# Altium project PCB_Project1.PrjPCB
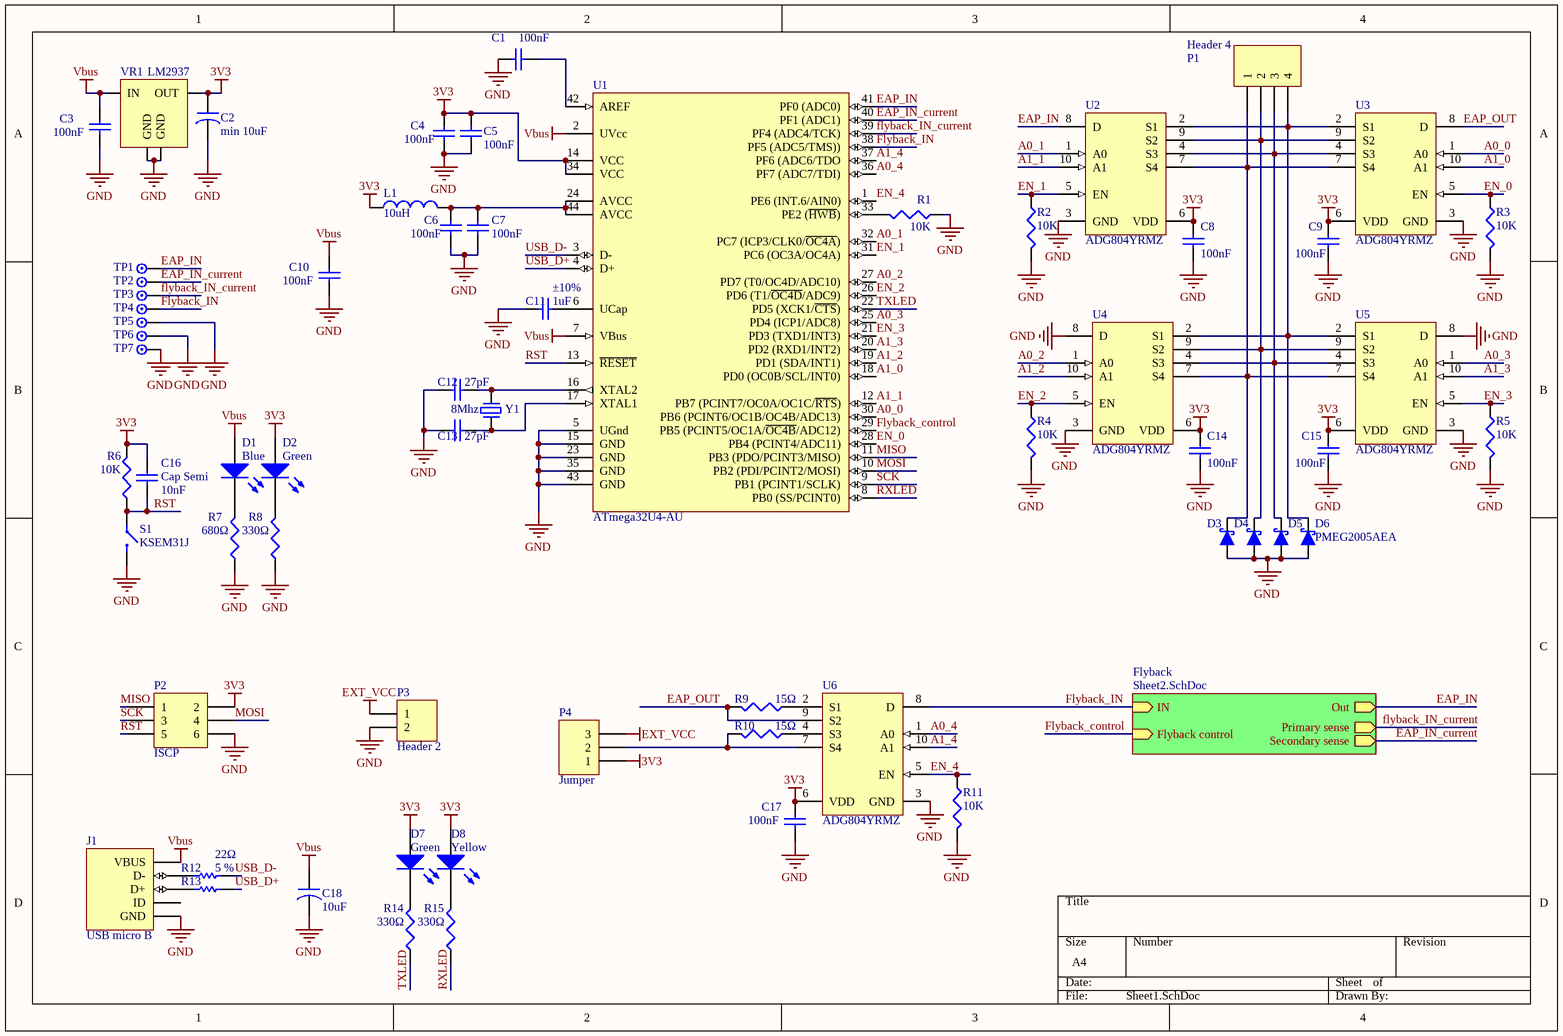
[diagram p0: Sheet1.SchDoc]
2 sheets, 79 parts. Net scope: hierarchical (ports join the sheet entries above them; power ports are global).
Board file: Third_PCB.PcbDoc
Sheets:
  Sheet1.SchDoc
    Flyback = Sheet2.SchDoc

## Sheet Sheet1.SchDoc
size A4

### Parts
C1  value 100nF  [1608[0603]]  (hidden comment: Cap Semi)
C2  min 10uF  [CAPMP3216X18N]
C3  value 100nF  [1608[0603]]  (hidden comment: Cap Semi)
C4  value 100nF  [1608[0603]]  (hidden comment: Cap Semi)
C5  value 100nF  [1608[0603]]  (hidden comment: Cap Semi)
C6  value 100nF  [1608[0603]]  (hidden comment: Cap Semi)
C7  value 100nF  [1608[0603]]  (hidden comment: Cap Semi)
C8  value 100nF  [1608[0603]]  (hidden comment: Cap Semi)
C9  value 100nF  [1608[0603]]  (hidden comment: Cap Semi)
C10  value 100nF  [1608[0603]]  (hidden comment: Cap Semi)
C11  value 1uF  Tolerance: ±10%  [CAPC0603(1608)100_L]  (hidden comment: CAP 1uF 25V 0603(1608))
C12  value 27pF  [CAPC0603(1608)100_N]  (hidden comment: CAP 27pF 50V 0603(1608))
C13  value 27pF  [CAPC0603(1608)100_N]  (hidden comment: CAP 27pF 50V 0603(1608))
C14  value 100nF  [1608[0603]]  (hidden comment: Cap Semi)
C15  value 100nF  [1608[0603]]  (hidden comment: Cap Semi)
C16  Cap Semi  value 10nF  [1608[0603]]
C17  value 100nF  [1608[0603]]  (hidden comment: Cap Semi)
C18  10uF  [CAPMP3216X18N]
D1  Blue  [1608[0603]]
D2  Green  [1608[0603]]
D3  PMEG2005AEA  [SOD323F]  (value not drawn)
D4  PMEG2005AEA  [SOD323F]  (value not drawn)
D5  PMEG2005AEA  [SOD323F]  (value not drawn)
D6  PMEG2005AEA  [SOD323F]
D7  Green  [1608[0603]]
D8  Yellow  [1608[0603]]
J1  USB micro B  [FCI MICRO USB B Receptable]
L1  value 10uH  [INDC4532]  (hidden comment: Inductor)
P1  Header 4  [HDR1X4]
P2  ISCP  [HDR2X3]
P3  Header 2  [HDR1X2]
P4  Jumper  [HDR1X3]
R1  value 10K  [J1-0603]  (hidden comment: Res3)
R2  value 10K  [J1-0603]  (hidden comment: Res3)
R3  value 10K  [J1-0603]  (hidden comment: Res3)
R4  value 10K  [J1-0603]  (hidden comment: Res3)
R5  value 10K  [J1-0603]  (hidden comment: Res3)
R6  value 10K  [J1-0603]  (hidden comment: Res3)
R7  value 680Ω  [J1-0603]  (hidden comment: Res3)
R8  value 330Ω  [J1-0603]  (hidden comment: Res3)
R9  value 15Ω  [J1-0603]  (hidden comment: Res3)
R10  value 15Ω  [J1-0603]  (hidden comment: Res3)
R11  value 10K  [J1-0603]  (hidden comment: Res3)
R12  value 22Ω  Tolerance: 5 %  [RESC0603(1608)_N]  (hidden comment: 22R 5% 0603(1608))
R13  22R 5% 0603(1608)  [RESC0603(1608)_N]  (value not drawn)
R14  value 330Ω  [J1-0603]  (hidden comment: Res3)
R15  value 330Ω  [J1-0603]  (hidden comment: Res3)
S1  KSEM31J  [KSEM31J]
TP1  Testpoint  [Hawin testpoint]  (value not drawn)
TP2  Testpoint  [Hawin testpoint]  (value not drawn)
TP3  Testpoint  [Hawin testpoint]  (value not drawn)
TP4  Testpoint  [Hawin testpoint]  (value not drawn)
TP5  Testpoint  [Hawin testpoint]  (value not drawn)
TP6  Testpoint  [Hawin testpoint]  (value not drawn)
TP7  Testpoint  [Hawin testpoint]  (value not drawn)
U1  ATmega32U4-AU  [44ML_M]
U2  ADG804YRMZ  [ADI-RM-10_L]
U3  ADG804YRMZ  [ADI-RM-10_L]
U4  ADG804YRMZ  [ADI-RM-10_L]
U5  ADG804YRMZ  [ADI-RM-10_L]
U6  ADG804YRMZ  [ADI-RM-10_L]
VR1  LM2937  [LM2937 - SOT230P700X180-4N]
Y1  8Mhz  [ABM3]

### Sub-sheets
Flyback = Sheet2.SchDoc: IN (in), Out (out), Primary sense (out), Secondary sense (out), Flyback control (in)

### Nets
3V3: C2.2 C4.2 C5.2 C8.2 C9.2 C14.2 C15.2 C16.2 C17.2 D2.1(A) D7.1(A) D8.1(A) L1.1 P2.2 P4.1 R6.2 U1.14(VCC) U1.34(VCC) U2.6(VDD) U3.6(VDD) U4.6(VDD) U5.6(VDD) U6.6(VDD) VR1.3(OUT)
EXT_VCC: P3.1 P4.3
GND: C1.2 C2.1 C3.1 C4.1 C5.1 C6.1 C7.1 C8.1 C9.1 C10.1 C11.1 C12.1 C13.1 C14.1 C15.1 C17.1 C18.1 D3.2 D4.2 D5.2 D6.2 J1.GND P2.6 P3.2 R1.1 R2.2 R3.2 R4.2 R5.2 R7.1 R8.1 R11.2 S1.1 TP5.0 TP6.0 TP7.0 U1.5(UGnd) U1.15(GND) U1.23(GND) U1.35(GND) U1.43(GND) U2.3(GND) U3.3(GND) U4.3(GND) U4.8(D) U5.3(GND) U5.8(D) U6.3(GND) VR1.2(GND) VR1.4(GND)
Vbus: C3.2 C10.2 C18.2 D1.1(A) J1.Vbus(VBUS) U1.2(UVcc) U1.7(VBus) VR1.1(IN)
A0_0: U1.30(PB6_(PCINT6/OC1B/OC4B/ADC13)) U3.1(A0)
A0_1: U1.32(PC7_(ICP3/CLK0/~{OC4A})) U2.1(A0)
A0_2: U1.27(PD7_(T0/OC4D/ADC10)) U4.1(A0)
A0_3: U1.25(PD4_(ICP1/ADC8)) U5.1(A0)
A0_4: U1.36(PF7_(ADC7/TDI)) U6.1(A0)
A1_0: U1.18(PD0_(OC0B/SCL/INT0)) U3.10(A1)
A1_1: U1.12(PB7_(PCINT7/OC0A/OC1C/~{RTS})) U2.10(A1)
A1_2: U1.19(PD1_(SDA/INT1)) U4.10(A1)
A1_3: U1.20(PD2_(RXD1/INT2)) U5.10(A1)
A1_4: U1.37(PF6_(ADC6/TDO) U6.10(A1)
EAP_IN: TP1.0 U1.41(PF0_(ADC0)) U2.8(D) ; sheet Flyback/Out
EAP_IN_current: TP2.0 U1.40(PF1_(ADC1)) ; sheet Flyback/Secondary sense
EAP_OUT: R9.1 U3.8(D) U6.9(S2)
EN_0: R3.1 U1.28(PB4_(PCINT4/ADC11)) U3.5(EN)
EN_1: R2.1 U1.31(PC6_(OC3A/OC4A)) U2.5(EN)
EN_2: R4.1 U1.26(PD6_(T1/~{OC4D}/ADC9)) U4.5(EN)
EN_3: R5.1 U1.21(PD3_(TXD1/INT3)) U5.5(EN)
EN_4: R11.1 U1.1(PE6_(INT.6/AIN0)) U6.5(EN)
Flyback_control: U1.29(PB5_(PCINT5/OC1A/~{OC4B}/ADC12)) ; sheet Flyback/Flyback control
Flyback_IN: TP4.0 U1.38(PF5_(ADC5/TMS))) U6.8(D) ; sheet Flyback/IN
flyback_IN_current: TP3.0 U1.39(PF4_(ADC4/TCK)) ; sheet Flyback/Primary sense
MISO: P2.1 U1.11(PB3_(PDO/PCINT3/MISO))
MOSI: P2.4 U1.10(PB2_(PDI/PCINT2/MOSI))
RST: C16.1 P2.5 R6.1 S1.0 U1.13(~{RESET})
RXLED: R15.1 U1.8(PB0_(SS/PCINT0))
SCK: P2.3 U1.9(PB1_(PCINT1/SCLK))
TXLED: R14.1 U1.22(PD5_(XCK1/~{CTS}))
USB_D+: R13.2 U1.4(D+)
USB_D-: R12.2 U1.3(D-)
NetC1_1: C1.1 U1.42(AREF)
NetC6_2: C6.2 C7.2 L1.2 U1.24(AVCC) U1.44(AVCC)
NetC11_2: C11.2 U1.6(UCap)
NetC12_2: C12.2 U1.16(XTAL2) Y1.1
NetC13_2: C13.2 U1.17(XTAL1) Y1.2
NetD1_2: D1.2(K) R7.2
NetD2_2: D2.2(K) R8.2
NetD3_1: D3.1 P1.1 U2.7(S4) U3.7(S4) U4.7(S4) U5.7(S4)
NetD4_1: D4.1 P1.2 U2.9(S2) U3.9(S2) U4.9(S2) U5.9(S2)
NetD5_1: D5.1 P1.3 U2.4(S3) U3.4(S3) U4.4(S3) U5.4(S3)
NetD6_1: D6.1 P1.4 U2.2(S1) U3.2(S1) U4.2(S1) U5.2(S1)
NetD7_2: D7.2(K) R14.2
NetD8_2: D8.2(K) R15.2
NetJ1_D+: J1.D+ R13.1
NetJ1_D-: J1.D- R12.1
NetP4_2: P4.2 R10.1 U6.7(S4)
NetR1_2: R1.2 U1.33(PE2_(~{HWB}))
NetR9_2: R9.2 U6.2(S1)
NetR10_2: R10.2 U6.4(S3)

Not connected (* = marked no-connect by the designer): J1 ID

### Library data of the parts
C1 C3-C10 C14-C17 = Cap Semi: Capacitor (Semiconductor SIM Model); Published: 8-Jun-2000; LatestRevisionDate: 29-May-2009; LatestRevisionNote: IPC-7351 Footprint Added.; PackageReference: C1206; Publisher: Altium Limited; PackageDescription: Chip Capacitor
C2 C18 = Tantalum
C11 = CMP-1035-00880-1: Case-Metric: 1608; Case-EIA: 0603; Technology: SMT; Rated Voltage: 25 V; Max Thickness: 1 mm
C12 C13 = CMP-1035-00010-1: Case-Metric: 1608; Tolerance: 5%; Case-EIA: 0603; Technology: SMT; Max Thickness: 1 mm; Rated Voltage: 50 V
D1 D2 D7 D8 = LED2: Typical RED, GREEN, YELLOW, AMBER GaAs LED; Published: 8-Jun-2000; LatestRevisionDate: 17-Jul-2002; LatestRevisionNote: Re-released for DXP Platform.; PackageVersion: Feb-2002; PackageReference: 3.2X1.6X1.1; Publisher: Altium Limited; PackageDescription: SM LED; 2 Flat Leads
L1 = Inductor: Code_IEC: 1005; Published: 8-Jun-2000; LatestRevisionDate: 29-May-2009; LatestRevisionNote: IPC-7351 Footprint Added.; PackageReference: 0402-A; Publisher: Altium Limited; PackageDescription: Chip Inductor; Code_JEITA: 0402
P1 = Header 4: Header, 4-Pin; LatestRevisionDate: 17-Jul-2002; LatestRevisionNote: Re-released for DXP Platform.; Publisher: Altium Limited
P2 = Header 3X2: Header, 3-Pin, Dual row; LatestRevisionDate: 17-Jul-2002; LatestRevisionNote: Re-released for DXP Platform.; Publisher: Altium Limited
P3 = Header 2: Header, 2-Pin; LatestRevisionDate: 17-Jul-2002; LatestRevisionNote: Re-released for DXP Platform.; Publisher: Altium Limited
P4 = Header 3: Header, 3-Pin; LatestRevisionDate: 17-Jul-2002; LatestRevisionNote: Re-released for DXP Platform.; Publisher: Altium Limited
R1-R11 R14 R15 = Res3: Resistor; Published: 8-Jun-2000; LatestRevisionDate: 29-May-2009; LatestRevisionNote: IPC-7351 Footprint Added.; PackageReference: J1-0603; Publisher: Altium Limited; PackageDescription: Chip Resistor
R12 = CMP-1012-00034-1: 22R 0.1W 5% 0603 (1608 Metric)  SMD; Case-EIA: 0603; Case-Metric: 1608; Technology: SMT; Power: 0.1 W
R13 = CMP-1012-00034-1: 22R 0.1W 5% 0603 (1608 Metric)  SMD; Value: 22.00 Ohm; Case-EIA: 0603; Case-Metric: 1608; Technology: SMT; Power: 0.1 W; Tolerance: 5 %
U1 = CMP-0095-00285-2: 8-bit AVR Microcontroller, 2.7-5.5V, 16MHz, 32KB Flash, 1KB EEPROM, 2.5KB SRAM, USB Controller, 44-pin TQFP, Industrial Grade (-40°C to 85°C), Ext Osc; RevisionNote: DatasheetVersion updated. URLs added.; ComponentLink1Description: Manufacturer URL; PackageDescription: 44-Pin Plastic Thin Quad Flat Pack, 10 x 10 x 1.0 mm Body, 0.8 mm Pitch (TQFP); DatasheetVersion: revF, Nov-2010; ComponentLink2URL: http://www.atmel.com/dyn/resources/prod_documents/doc7766.pdf; ComponentLink1URL: http://www.atmel.com/; PackageReference: 44ML; ComponentLink2Description: ATmega16U4/32U4 Datasheet; PackageVersion: rev.G, Jul-2007; ComponentLink3URL: http://www.atmel.com/dyn/resources/prod_documents/7766S.pdf; ComponentLink3Description: ATmega16U4 ATmega32U4 Summary
U2-U6 = CMP-0798-00106-1: 1.65 to 3.6 V, CMOS, 0.5 Ohm, 4-Channel Multiplexer, -40 to 125 degC, 10-pin SOP (RM-10), Tube; Manufacturer: Analog Devices; Supply V Guar Performance: Single_(+2.5V), Single_(+3.3V), Single_(+3V); Bandwidth (Hz): 33M; Ron (ohms): 500; Max Analog Signal Range: 0 to Vdd; t transition (s): 24n; ComponentLink2URL: http://www.analog.com/static/imported-files/data_sheets/ADG804.pdf; PackageDescription: 10-Pin Mini Small Outline Package, Body 3 x 3 mm, Pitch 0.5 mm; PackageVersion: Aug-05; Mounting Technology: Surface Mount; PackageReference: RM-10; Code_JEDEC: MO-187-BA; DatasheetVersion: Rev. A; Packing: Tube; ComponentLink3URL: http://www.analog.com/static/imported-files/packages/PKG_PDF/MSOP%28RM%29/RM_10.pdf; ComponentLink1Description: Manufacturer URL; ComponentLink2Description: Datasheet; ComponentLink3Description: Package Specification; PartNumber: ADG804YRMZ; ComponentLink1URL: http://www.analog.com/en/index.html
Y1 = Abracon ABM3 Crystal

## Sheet Sheet2.SchDoc
size A4
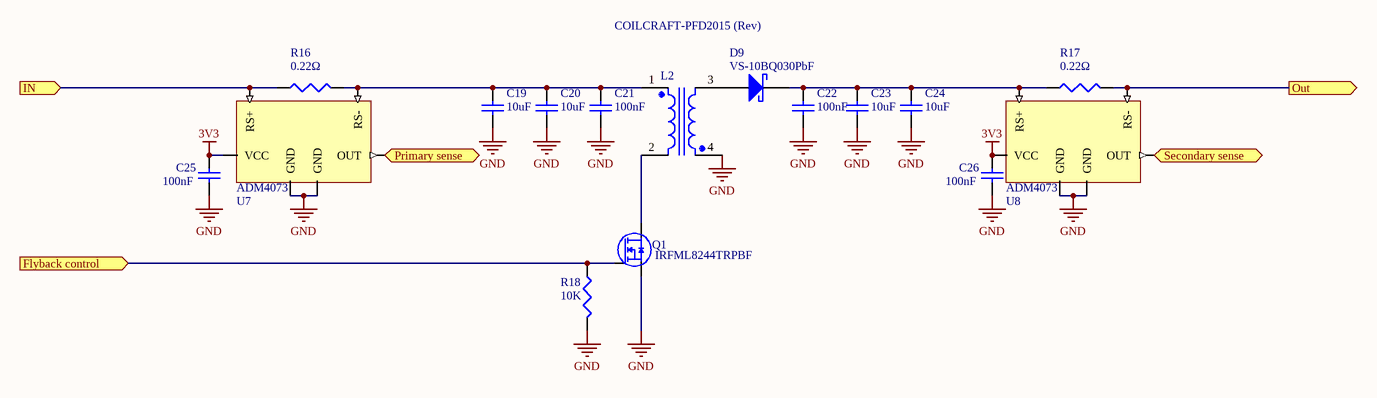
[diagram p1: Sheet2.SchDoc]

### Parts
C19  value 10uF  [6-0805_M]  (hidden comment: Cap Semi)
C20  value 10uF  [6-0805_M]  (hidden comment: Cap Semi)
C21  value 100nF  [1608[0603]]  (hidden comment: Cap Semi)
C22  value 100nF  [1608[0603]]  (hidden comment: Cap Semi)
C23  value 10uF  [6-0805_M]  (hidden comment: Cap Semi)
C24  value 10uF  [6-0805_M]  (hidden comment: Cap Semi)
C25  value 100nF  [1608[0603]]  (hidden comment: Cap Semi)
C26  value 100nF  [1608[0603]]  (hidden comment: Cap Semi)
D9  VS-10BQ030PbF  [VS-10BQ030PbF - DIOM4435X24N]
L2  COILCRAFT-PFD2015 (Rev)  [PFD2015]
Q1  IRFML8244TRPBF  [SOT95P237X112-3N]
R16  value 0.22Ω  [RESC6332]  (hidden comment: Res3)
R17  value 0.22Ω  [RESC6332]  (hidden comment: Res3)
R18  value 10K  [J1-0603]  (hidden comment: Res3)
U7  ADM4073  [ADM4073 - SOT95P280X145-6N]
U8  ADM4073  [ADM4073 - SOT95P280X145-6N]

### Ports
Flyback control (in), IN (in), Out (out), Primary sense (out), Secondary sense (out)

### Nets
3V3: C25.2 C26.2 U7.3(VCC) U8.3(VCC)
GND: C19.1 C20.1 C21.1 C22.1 C23.1 C24.1 C25.1 C26.1 L2.4 Q1.2(S) R18.2 U7.1(GND) U7.2(GND) U8.1(GND) U8.2(GND)
EAP_IN: R17.2 U8.5(RS-) ; port Out
EAP_IN_current: U8.6(OUT) ; port Secondary sense
Flyback_control: Q1.1(G) R18.1 ; port Flyback control
Flyback_IN: R16.1 U7.4(RS+) ; port IN
flyback_IN_current: U7.6(OUT) ; port Primary sense
NetC19_2: C19.2 C20.2 C21.2 L2.1 R16.2 U7.5(RS-)
NetC22_2: C22.2 C23.2 C24.2 D9.1 R17.1 U8.4(RS+)
NetD9_2: D9.2 L2.3
NetL2_2: L2.2 Q1.3(D)

### Library data of the parts
C19-C26 = Cap Semi: Capacitor (Semiconductor SIM Model); Published: 8-Jun-2000; LatestRevisionDate: 29-May-2009; LatestRevisionNote: IPC-7351 Footprint Added.; PackageReference: C1206; Publisher: Altium Limited; PackageDescription: Chip Capacitor
Q1 = IRFML8244TRPBF: INTERNATIONAL RECTIFIER - IRFML8244TRPBF - N CH MOSFET, 25V, 5.8A, 3-SOT-23, FULL REEL; Transistor Polarity: N Channel; Continuous Drain Current Id: 5.8; Drain Source Voltage Vds: 25; On Resistance Rds(on): 20; Rds(on) Test Voltage Vgs: 10; Threshold Voltage Vgs: 1.7; Supplier 1: Farnell; Manufacturer: INTERNATIONAL RECTIFIER; Manufacturer Part Number: IRFML8244TRPBF; RoHS: YES; Pricing 1: 3000=0.24, 6000=0.22, 9000=0.21 (EUR); ComponentLink1URL: http://www.irf.com/product-info/datasheets/data/irfml8244pbf.pdf; ComponentLink1Description: http://www.irf.com/product-info/datasheets/data/irfml8244pbf.pdf
R16-R18 = Res3: Resistor; Published: 8-Jun-2000; LatestRevisionDate: 29-May-2009; LatestRevisionNote: IPC-7351 Footprint Added.; PackageReference: J1-0603; Publisher: Altium Limited; PackageDescription: Chip Resistor
L2 = COILCRAFT-PFD2015 (Rev): Inductance@0A: *; Inductance@IpkA: *

## Nets that join several sheets
3V3: Sheet1 (24 pins), Sheet2 (C25.2 C26.2 U7.3 U8.3)
GND: Sheet1 (50 pins), Sheet2 (15 pins)
EAP_IN: Sheet1 (TP1.0 U1.41 U2.8), Sheet2 (R17.2 U8.5)
EAP_IN_current: Sheet1 (TP2.0 U1.40), Sheet2 (U8.6)
Flyback_control: Sheet1 (U1.29), Sheet2 (Q1.1 R18.1)
Flyback_IN: Sheet1 (TP4.0 U1.38 U6.8), Sheet2 (R16.1 U7.4)
flyback_IN_current: Sheet1 (TP3.0 U1.39), Sheet2 (U7.6)